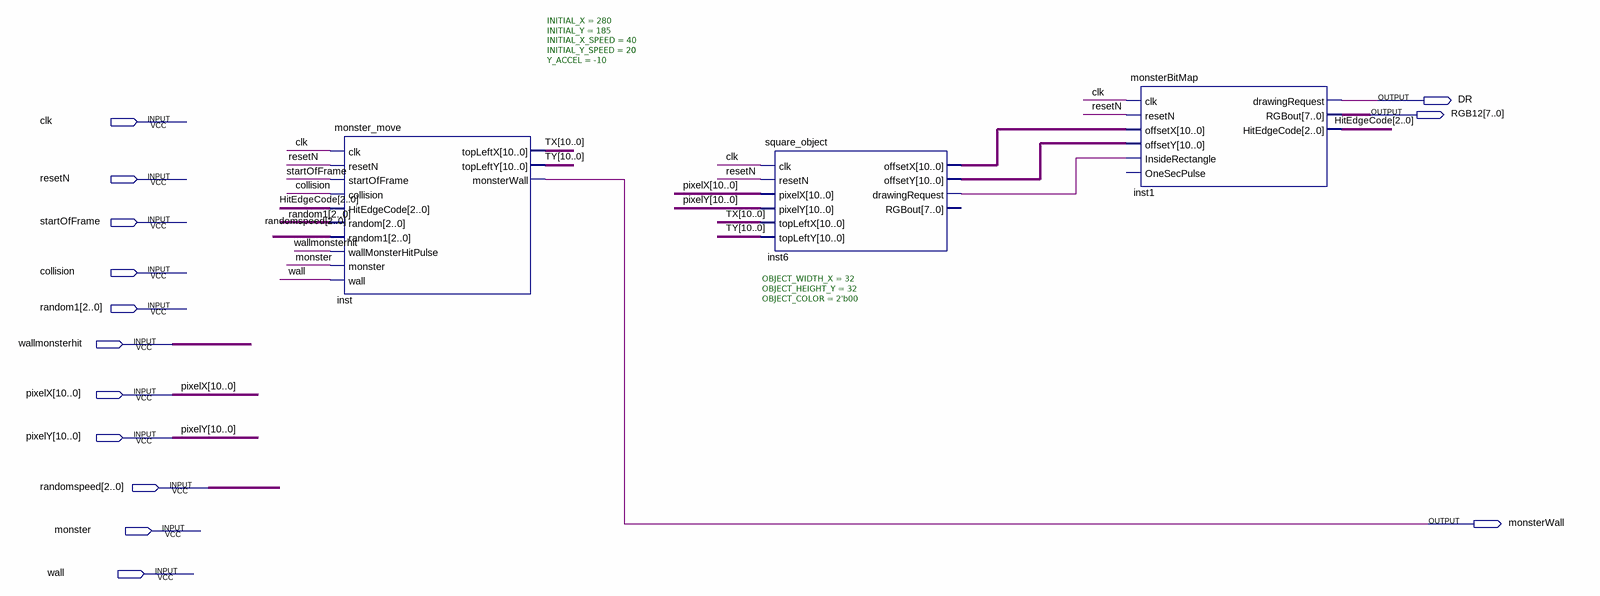
[diagram p0: schematic sheet]
// Quartus schematic monsterBlock_T.bdf as structural Verilog: 3 symbols, 14 pins
module monsterBlock_T (
  input  clk,
  input  resetN,
  input  startOfFrame,
  input  collision,
  input  [2:0] random1,
  input  wallmonsterhit,
  input  [10:0] pixelX,
  input  [10:0] pixelY,
  input  [2:0] randomspeed,
  input  monster,
  input  wall,
  output DR,
  output [7:0] RGB12,
  output monsterWall
);

  wire inst6_drawingrequest;
  wire [2:0] HitEdgeCode;
  wire [10:0] inst6_offsetx, inst6_offsety, TX, TY;

  monster_move #(.INITIAL_X(280), .INITIAL_Y(185), .INITIAL_X_SPEED(40), .INITIAL_Y_SPEED(20), .Y_ACCEL(-10)) inst (
    .clk(clk), .resetN(resetN), .startOfFrame(startOfFrame), .collision(collision),
    .HitEdgeCode(HitEdgeCode), .random(random1), .random1(randomspeed), .wallMonsterHitPulse(wallmonsterhit),
    .monster(monster), .wall(wall), .topLeftX(TX), .topLeftY(TY), .monsterWall(monsterWall));
  square_object #(.OBJECT_WIDTH_X(32), .OBJECT_HEIGHT_Y(32), .OBJECT_COLOR(2'b00)) inst6 (
    .clk(clk), .resetN(resetN), .pixelX(pixelX), .pixelY(pixelY), .topLeftX(TX), .topLeftY(TY),
    .offsetX(inst6_offsetx), .offsetY(inst6_offsety), .drawingRequest(inst6_drawingrequest));  // open: RGBout
  monsterBitMap inst1 (
    .clk(clk), .resetN(resetN), .offsetX(inst6_offsetx), .offsetY(inst6_offsety),
    .InsideRectangle(inst6_drawingrequest), .drawingRequest(DR), .RGBout(RGB12), .HitEdgeCode(HitEdgeCode));  // open: OneSecPulse
endmodule
